# Altium schematic sheet MK.SchDoc
size A4
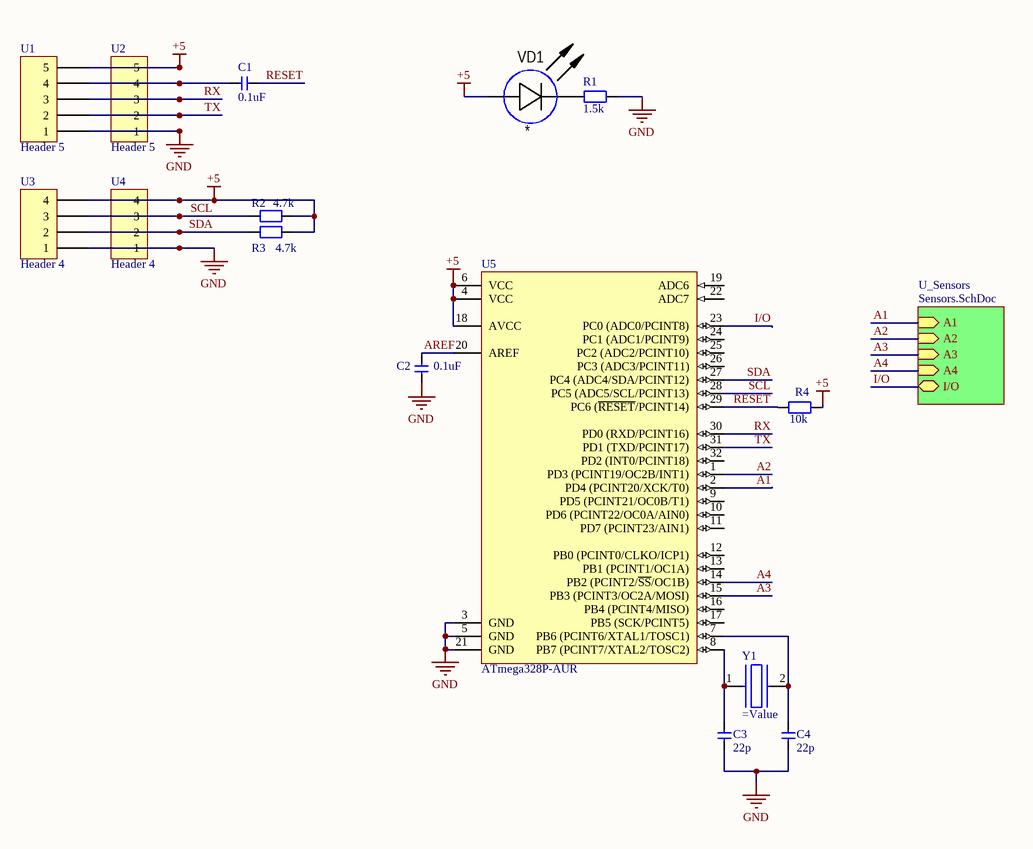
[diagram p0: MK.SchDoc]

## Parts
C1  0.1uF  [cap0603]
C2  0.1uF  [cap0603]
C3  22p  [cap0603]
C4  22p  [cap0603]
R1  1.5k  [res0603]
R2  4.7k  [res0603]
R3  4.7k  [res0603]
R4  10k  [res0603]
U1  Header 5  [5x2.54]
U2  Header 5  [5x1.27]
U3  Header 4  [CON: PLS-4]
U4  Header 4  [4x1.25]
U5  ATmega328P-AUR  [32A_N]
VD1  *  [CH0603LB]
Y1  (no value)  [QSMD3.2x2.5_A]

## Sub-sheets
U_Sensors = Sensors.SchDoc: A1 (in), A2 (in), A3 (in), A4 (in), I/O (bidir)

## Nets
+5: R2.2 R3.2 R4.2 U1.5 U2.5 U3.4 U4.4 U5.4(VCC) U5.6(VCC) U5.18(AVCC) VD1.1(A)
GND: C2.1 C3.2 C4.2 R1.2 U1.1 U2.1 U3.1 U4.1 U5.3(GND) U5.5(GND) U5.21(GND)
A1: U5.2(PD4_(PCINT20/XCK/T0)) ; sheet U_Sensors/A1
A2: U5.1(PD3_(PCINT19/OC2B/INT1)) ; sheet U_Sensors/A2
A3: U5.15(PB3_(PCINT3/OC2A/MOSI)) ; sheet U_Sensors/A3
A4: U5.14(PB2_(PCINT2/~{SS}/OC1B)) ; sheet U_Sensors/A4
AREF: C2.2 U5.20(AREF)
I/O: U5.23(PC0_(ADC0/PCINT8)) ; sheet U_Sensors/I/O
RESET: C1.2 R4.1 U5.29(PC6_(~{RESET}/PCINT14))
RX: U1.3 U2.3 U5.30(PD0_(RXD/PCINT16))
SCL: R2.1 U3.3 U4.3 U5.28(PC5_(ADC5/SCL/PCINT13))
SDA: R3.1 U3.2 U4.2 U5.27(PC4_(ADC4/SDA/PCINT12))
TX: U1.2 U2.2 U5.31(PD1_(TXD/PCINT17))
NetC1_1: C1.1 U1.4 U2.4
NetC3_1: C3.1 U5.8(PB7_(PCINT7/XTAL2/TOSC2)) Y1.1
NetC4_1: C4.1 U5.7(PB6_(PCINT6/XTAL1/TOSC1)) Y1.2
NetR1_1: R1.1 VD1.2(C)

Not connected (* = marked no-connect by the designer): U5 9(PD5_(PCINT21/OC0B/T1)) 10(PD6_(PCINT22/OC0A/AIN0)) 11(PD7_(PCINT23/AIN1)) 12(PB0_(PCINT0/CLKO/ICP1)) 13(PB1_(PCINT1/OC1A)) 16(PB4_(PCINT4/MISO)) 17(PB5_(SCK/PCINT5)) 19(ADC6) 22(ADC7) 24(PC1_(ADC1/PCINT9)) 25(PC2_(ADC2/PCINT10)) 26(PC3_(ADC3/PCINT11)) 32(PD2_(INT0/PCINT18))

## Library data of the parts
C1-C4 = Cap SMD
R1-R4 = Resistor SMD
U5 = ATmega328P-AUR: 8-bit AVR Microcontroller, 32KB Flash, 1KB EEPROM, 2KB SRAM, 32-pin TQFP, Industrial Grade (-40°C to 85°C); Published: 1-Apr-2010; DatasheetVersion: revA, Jan-2010; PackageVersion: revB, Oct-2001; PackageReference: 32A; Publisher: Altium Limited; PackageDescription: 32-Lead, 7x7x1.0 mm Body, 0.8mm Lead Pitch, Thin Profile Plastic Quad Flat Package (TQFP); Supplier 1: Digi-Key; Supplier Part Number 1: ATMEGA328P-AUR-ND; Supplier 2: Mouser; Supplier Part Number 2: 556-ATMEGA328P-AUR; Code_JEDEC: MS-026-ABA; ComponentLink1Description: Manufacturer Link; ComponentLink1URL: http://www.atmel.com/products/avr/default.asp?; ComponentLink2Description: ATmega48A/48PA/88A/88PA/168A/168PA/328/328P Datasheet; ComponentLink2URL: http://www.atmel.com/dyn/resources/prod_documents/8271.pdf; ComponentLink3Description: ATmega48A/48PA/88A/88PA/168A/168PA/328/328P Summary; ComponentLink3URL: http://www.atmel.com/dyn/resources/prod_documents/8271S.pdf; ComponentLink4Description: Atmel.com Home; ComponentLink4URL: http://www.atmel.com
VD1 = LED: Manufacturer: *; Model: *; HelpURL: *; ComponentKind: *; Value: *
Y1 = Quartz